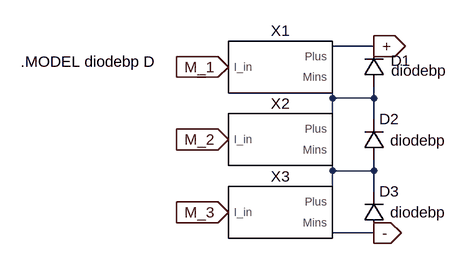
[diagram p0: schematic PV_panel.asc]
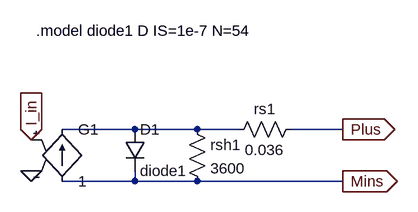
[diagram p1: sub-circuit module.asc]
PV_panel.asc, the LTspice schematic file:
Version 4
SHEET 1 880 680
WIRE 352 96 288 96
WIRE 288 112 288 96
WIRE 288 176 288 144
WIRE 352 176 352 160
WIRE 352 176 288 176
WIRE 352 208 352 176
WIRE 288 224 288 176
WIRE 288 288 288 256
WIRE 352 288 352 272
WIRE 352 288 288 288
WIRE 352 320 352 288
WIRE 288 336 288 288
WIRE 288 384 288 368
WIRE 352 384 288 384
FLAG 128 128 M_1
IOPIN 128 128 In
FLAG 128 240 M_2
IOPIN 128 240 In
FLAG 128 352 M_3
IOPIN 128 352 In
FLAG 352 96 +
IOPIN 352 96 Out
FLAG 352 384 -
IOPIN 352 384 Out
SYMBOL module 208 128 R0
SYMATTR InstName X1
SYMBOL module 208 240 R0
SYMATTR InstName X2
SYMBOL module 208 352 R0
SYMATTR InstName X3
SYMBOL diode 336 160 M180
WINDOW 0 42 42 Left 2
WINDOW 3 43 26 Left 2
SYMATTR InstName D1
SYMATTR Value diodebp
SYMBOL diode 336 272 M180
WINDOW 0 24 64 Left 2
WINDOW 3 41 31 Left 2
SYMATTR InstName D2
SYMATTR Value diodebp
SYMBOL diode 336 384 M180
WINDOW 0 24 64 Left 2
WINDOW 3 41 32 Left 2
SYMATTR InstName D3
SYMATTR Value diodebp
TEXT -192 120 Left 2 !.MODEL diodebp D

module.asc, the sub-circuit schematic file:
Version 4
SHEET 1 880 680
WIRE 128 64 16 64
WIRE 224 64 128 64
WIRE 288 64 224 64
WIRE 448 64 368 64
WIRE 128 144 128 128
WIRE 128 144 16 144
WIRE 224 144 128 144
WIRE 448 144 224 144
FLAG -32 128 0
FLAG -32 80 I_in
IOPIN -32 80 In
FLAG 448 64 Plus
IOPIN 448 64 Out
FLAG 448 144 Mins
IOPIN 448 144 Out
SYMBOL diode 112 64 R0
SYMATTR InstName D1
SYMATTR Value diode1
SYMBOL res 208 48 R0
SYMATTR InstName rsh1
SYMATTR Value 3600
SYMBOL res 384 48 R90
WINDOW 0 0 56 VBottom 2
WINDOW 3 32 56 VTop 2
SYMATTR InstName rs1
SYMATTR Value 0.036
SYMBOL g 16 48 R0
SYMATTR InstName G1
SYMATTR Value 1
TEXT -24 -88 Left 2 !.model diode1 D IS=1e-7 N=54

The netlist it stands for:
* PV_panel.asc
XX1 M_1 + N001 module
XX2 M_2 N001 N002 module
XX3 M_3 N002 - module
D1 N001 + diodebp
D2 N002 N001 diodebp
D3 - N002 diodebp

* block symbol definitions
.subckt module I_in Plus Mins
D1 N001 Mins diode1
rsh1 N001 Mins 3600
rs1 Plus N001 0.036
G1 Mins N001 I_in 0 1
.model diode1 D IS=1e-7 N=54
.ends module

.model D D
.lib standard.dio
.MODEL diodebp D
.backanno
.end